# EAGLE design placasensores (EAGLE 9.6.2)
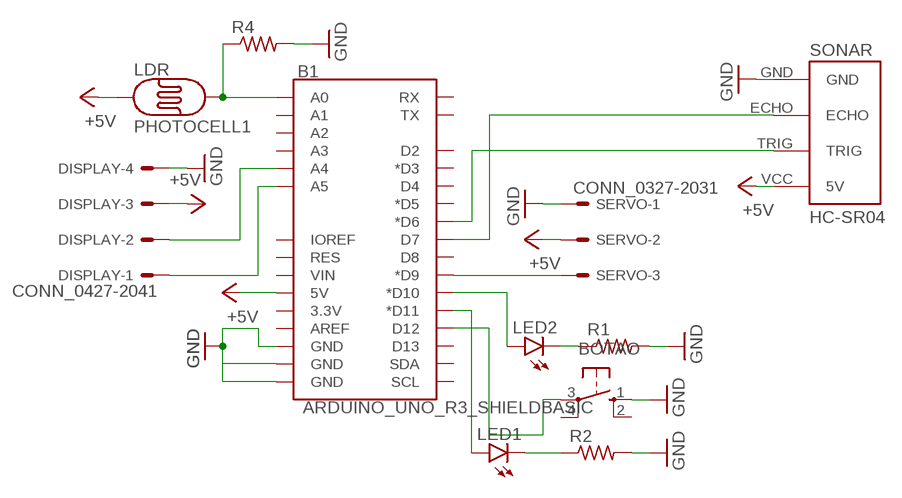
[diagram p0: schematic, sheet 1]

## Parts
B1  ARDUINO_UNO_R3_SHIELDBASIC  [UNO_R3_SHIELD]
BOTAO  10-XX  [B3F-10XX]
DISPLAY  CONN_0427-2041  [6410-04]
LDR  PHOTOCELL1  [LDR_OFFBOARD]
LED1  LED5MM  [LED5MM]
LED2  LED5MM  [LED5MM]
R1  R-US_0204/5  [0204/5]
R2  R-US_0204/5  [0204/5]
R4  R-US_0204/5  [0204/5]
SERVO  CONN_0327-2031  [6410-03]
SONAR  HC-SR04  [HC-SR04_FOOTPRINT]

## Nets
+5V: B1.5V DISPLAY.3 LDR.1 SERVO.2 SONAR.VCC(5V)
GND: B1.GND@0(GND) B1.GND@1(GND) B1.GND@2(GND) BOTAO.1(S) DISPLAY.4 R1.2 R2.2 R4.2 SERVO.1 SONAR.GND
N$1: B1.D12 BOTAO.3(P)
N$2: B1.D10(*D10) LED2.A
N$3: B1.D11(*D11) LED1.A
N$4: LED2.K(C) R1.1
N$5: LED1.K(C) R2.1
N$6: B1.A0 LDR.2 R4.1
N$7: B1.D7 SONAR.ECHO
N$8: B1.D6(*D6) SONAR.TRIG
N$9: B1.D9(*D9) SERVO.3
N$10: B1.A5 DISPLAY.1
N$11: B1.A4 DISPLAY.2
Unconnected: B1.3.3V B1.A1 B1.A2 B1.A3 B1.AREF B1.D2 B1.D3(*D3) B1.D4 B1.D5(*D5) B1.D8 B1.D13 B1.IOREF B1.RES B1.RX B1.SCL B1.SDA B1.TX B1.VIN BOTAO.2(S1) BOTAO.4(P1)

## Library data of the parts
B1 = Robotica-IFRN-SC-Arduino:ARDUINO_UNO_R3_SHIELD: Arduino R3 Shield Footprint Shield form compatible with the Arduino Uno R3. SparkFun Products: MG2639 Cellular Shield <https://www.sparkfun.com/products/13120> MIDI Shield <https://www.sparkfun.com/products/12898> R3 Stackable Headers Kit <https://www.sparkfun.com/products/11417>
BOTAO = switch-omron:10-XX: OMRON SWITCH; MPN: B3F-1000; OC_FARNELL: 176432; OC_NEWARK: 36M3542
DISPLAY = Robotica-IFRN-SC-conectores:CONN_04: CONNECTOR wire to board 2.54 mm (.1 inch) pitch header; OC_FARNELL: unknown; OC_NEWARK: unknown
LDR = ldr:PHOTOCELL: Photo Resitor
LED1 LED2 = led:LED: LED OSRAM: - CHIPLED LG R971, LG N971, LY N971, LG Q971, LY Q971, LO R971, LY R971 LH N974, LH R974 LS Q976, LO Q976, LY Q976 LO Q996 - Hyper CHIPLED LW Q18S LB Q993, LB Q99A, LB R99A - SideLED LS A670, LO A670, LY A670, LG A670, LP A670 LB A673, LV A673, LT A673, LW A673 LH A674 LY A675 LS A676, LA A676, LO A676, LY A676, LW A676 LS A679, LY A679, LG A679 - Hyper Micro SIDELED® LS Y876, LA Y876, LO Y876, LY Y876 LT Y87S - SmartLED LW L88C, LW L88S LB L89C, LB L89S, LG L890 LS L89K, LO L89K, LY L89K LS L896, LA L896, LO L896, LY L896 - TOPLED LS T670, LO T670, LY T670, LG T670, LP T670 LSG T670, LSP T670, LSY T670, LOP T670, LYG T670 LG T671, LOG T671, LSG T671 LB T673, LV T673, LT T673, LW T673 LH T674 LS T676, LA T676, LO T676, LY T676, LB T676, LH T676, LSB T676, LW T676 LB T67C, LV T67C, LT T67C, LS T67K, LO T67K, LY T67K, LW E67C LS E67B, LA E67B, LO E67B, LY E67B, LB E67C, LV E67C, LT E67C LW T67C LS T679, LY T679, LG T679 LS T770, LO T770, LY T770, LG T770, LP T770 LB T773, LV T773, LT T773, LW T773 LH T774 LS E675, LA E675, LY E675, LS T675 LS T776, LA T776, LO T776, LY T776, LB T776 LHGB T686 LT T68C, LB T68C - Hyper Mini TOPLED® LB M676 - Mini TOPLED Santana® LG M470 LS M47K, LO M47K, LY M47K Source: http://www.osram.convergy.de LUXEON: - LUMILED® LXK2-PW12-R00, LXK2-PW12-S00, LXK2-PW14-U00, LXK2-PW14-V00 LXK2-PM12-R00, LXK2-PM12-S00, LXK2-PM14-U00 LXK2-PE12-Q00, LXK2-PE12-R00, LXK2-PE12-S00, LXK2-PE14-T00, LXK2-PE14-U00 LXK2-PB12-K00, LXK2-PB12-L00, LXK2-PB12-M00, LXK2-PB14-N00, LXK2-PB14-P00, LXK2-PB14-Q00 LXK2-PR12-L00, LXK2-PR12-M00, LXK2-PR14-Q00, LXK2-PR14-R00 LXK2-PD12-Q00, LXK2-PD12-R00, LXK2-PD12-S00 LXK2-PH12-R00, LXK2-PH12-S00 LXK2-PL12-P00, LXK2-PL12-Q00, LXK2-PL12-R00 Source: www.luxeon.com KINGBRIGHT: KA-3528ASYC Source: www.kingbright.com
R1 R2 R4 = rcl:R-US_: RESISTOR, American symbol; SPICEPREFIX: R
SERVO = Robotica-IFRN-SC-conectores:CONN_03: CONNECTOR wire to board 2.54 mm (.1 inch) pitch header; OC_FARNELL: unknown; OC_NEWARK: unknown
SONAR = SONAR:HC-SR04: Ultrasonic Sensor HC-SR04

## Net classes
0 default: clearance 0.205 mm

## Board
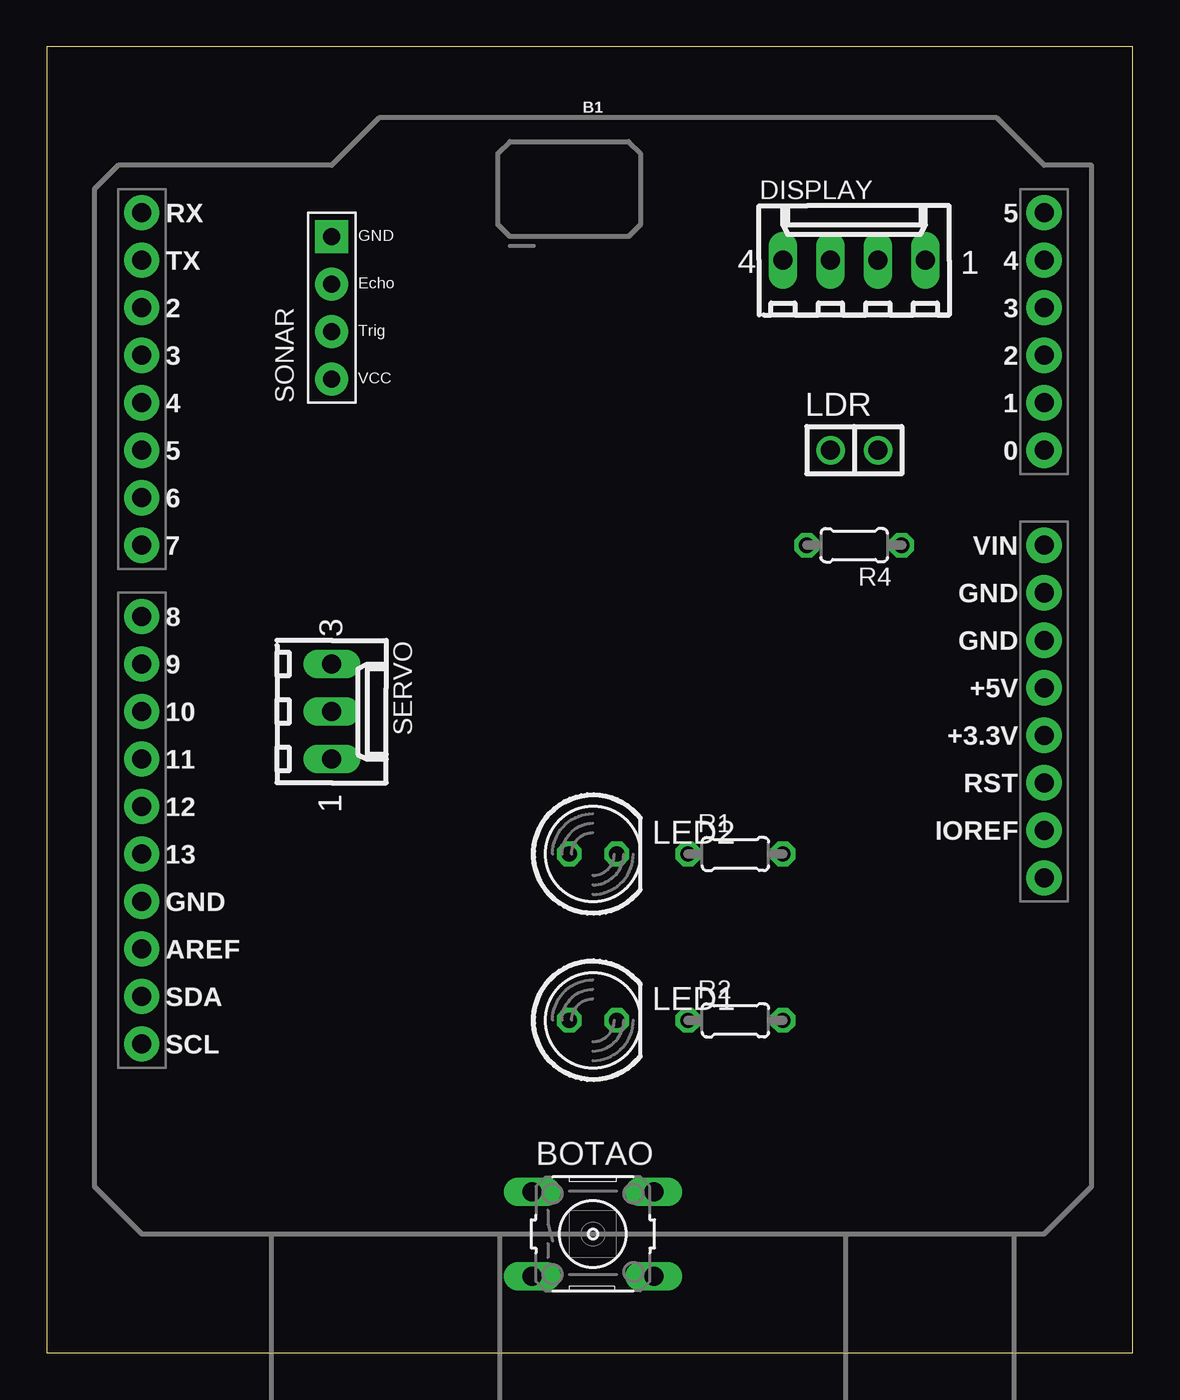
[diagram p1: board, top side]
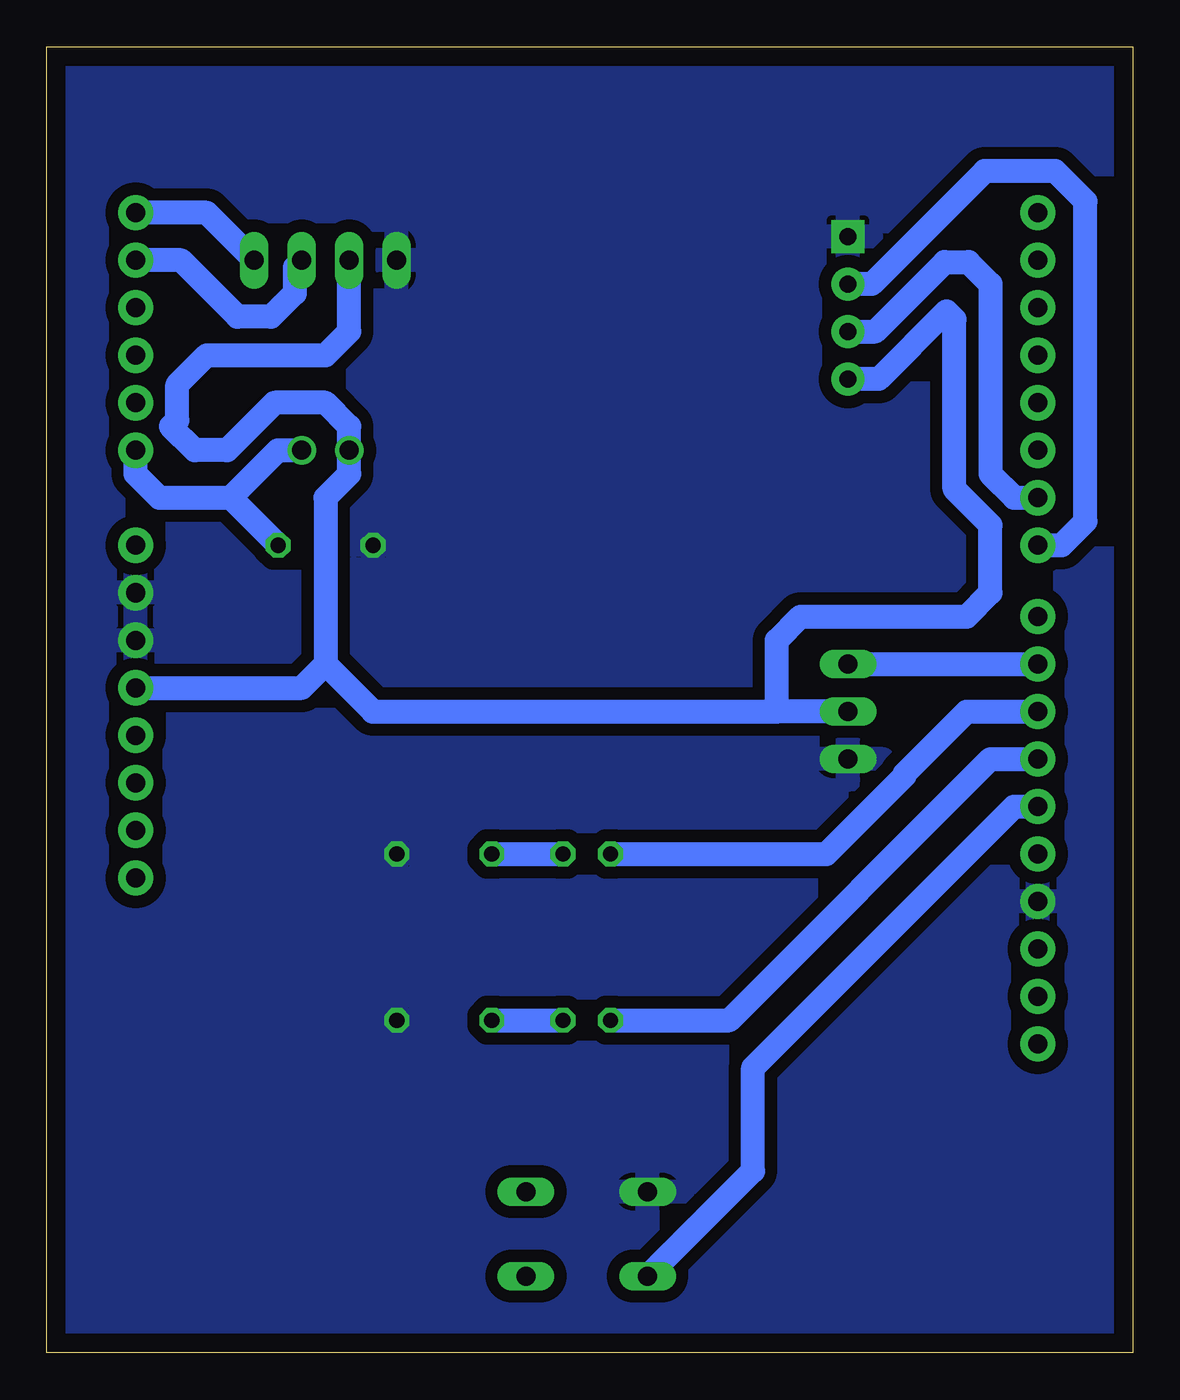
[diagram p2: board, bottom side, seen from below]

Size 58.09 x 69.84 mm. Coordinates in mm from the lower left corner, seen from the top.
Outline: 58.09,69.84 0,69.84 0,0 58.09,0 58.09,69.84
Copper layers (1*16): Top 0.035mm / dielectric 1.5mm / Bottom 0.035mm
Design rules "default *": minimum track width 6mil, minimum drill 24mil, track to track 26mil, track to pad 26mil, pad to pad 26mil, via to via 26mil, smd to smd 8mil, copper to edge 40mil, drill to drill 8mil, minimum pad ring 10mil, minimum via ring 8mil, stop-mask expansion 4mil, vias tented up to drill 0mil, thermal gap 10mil

### Footprints (pad centres in the part's own frame; a part is rotated, then mirrored left to right if it is on the bottom)
UNO_R3_SHIELD = drill 1.016 pad 1.88: 3.3V 24.13,-2.54; 5V 24.13,0; A0 24.13,12.7; A1 24.13,15.24; A2 24.13,17.78; A3 24.13,20.32; A4 24.13,22.86; A5 24.13,25.4; AREF -24.13,-13.97; D2 -24.13,20.32; D3 -24.13,17.78; D4 -24.13,15.24; D5 -24.13,12.7; D6 -24.13,10.16; D7 -24.13,7.62; D8 -24.13,3.81; D9 -24.13,1.27; D10 -24.13,-1.27; D11 -24.13,-3.81; D12 -24.13,-6.35; D13 -24.13,-8.89; GND@0 24.13,2.54; GND@1 24.13,5.08; GND@2 -24.13,-11.43; IOREF 24.13,-7.62; NC 24.13,-10.16; RES 24.13,-5.08; RX -24.13,25.4; SCL -24.13,-19.05; SDA -24.13,-16.51; TX -24.13,22.86; VIN 24.13,7.62
B3F-10XX = drill 1.016 long: 1 -3.251,2.261; 2 3.251,2.261; 3 -3.251,-2.261; 4 3.251,-2.261
6410-04 = drill 1.016 long: 1 3.81,0; 2 1.27,0; 3 -1.27,0; 4 -3.81,0
LDR_OFFBOARD = drill 1.016: 1 -1.27,0; 2 1.27,0
LED5MM = drill 0.813 octagon: A -1.27,0; K 1.27,0
0204/5 = drill 0.813 octagon: 1 -2.54,0; 2 2.54,0
6410-03 = drill 1.016 long: 1 2.54,0; 2 0,0; 3 -2.54,0
HC-SR04_FOOTPRINT = drill 0.9 pad 1.778: ECHO 0,1.27; TRIG 0,-1.27; VCC 0,-3.81 | drill 0.9 pad 1.778 square: GND 0,3.81

### Placement (x,y rotation side)
B1  29.21,35.56 0 top
BOTAO  29.21,6.35 0 top
DISPLAY  43.18,58.42 0 top
LDR  43.18,48.26 0 top
LED1  29.21,17.78 0 top
LED2  29.21,26.67 0 top
R1  36.83,26.67 0 top
R2  36.83,17.78 0 top
R4  43.18,43.18 180 top
SERVO  15.24,34.29 270 top
SONAR  15.24,55.88 0 top

### Tracks (layer width: path | path; a pad name or v marks a point on that pad's centre or on a via)
+5V
  Bottom 1.27: B1.5V 44.45,35.56 43.18,36.83 | 43.18,36.83 43.18,45.72 41.91,46.99 LDR.1 41.91,49.53 43.18,50.8 45.91,50.8 48.45,48.26 50.18,48.26 51.45,49.53 51.11,49.87 51.11,51.77 49.53,53.34 43.18,53.34 41.91,54.61 DISPLAY.3 | 43.18,36.83 40.64,34.29 19.05,34.29 | SERVO.2 19.05,34.29 | 19.05,34.29 19.05,38.1 17.78,39.37 8.89,39.37 7.62,40.64 7.62,44.26 9.55,46.19 9.55,55.27 9.97,55.69 13.59,52.07 SONAR.VCC
GND
  pour Bottom: 0,69.85 58.42,69.85 58.42,0 0,0
N$1
  Bottom 1.27: BOTAO.3 20.32,9.73 20.32,15.24 6.35,29.21 B1.D12
N$2
  Bottom 1.27: LED2.A 16.4,26.67 12.22,30.86 12.22,30.96 8.89,34.29 B1.D10
N$3
  Bottom 1.27: LED1.A 21.59,17.78 7.62,31.75 B1.D11
N$4
  Bottom 1.27: R1.1 LED2.K
N$5
  Bottom 1.27: R2.1 LED1.K
N$6
  Bottom 1.27: R4.1 48.26,45.72 | 48.26,45.72 52.07,45.72 53.34,46.99 B1.A0 | 48.26,45.72 45.72,48.26 LDR.2
N$7
  Bottom 1.27: B1.D7 3.81,43.18 2.54,44.45 2.54,61.58 4.15,63.2 7.93,63.2 13.97,57.15 SONAR.ECHO
N$8
  Bottom 1.27: SONAR.TRIG 13.78,54.61 10.07,58.33 8.79,58.33 7.62,57.15 7.62,46.99 6.35,45.72 B1.D6
N$9
  Bottom 1.27: SERVO.3 B1.D9
N$10
  Bottom 1.27: DISPLAY.1 49.53,60.96 B1.A5
N$11
  Bottom 1.27: DISPLAY.2 44.83,58.04 44.83,56.66 46.1,55.4 47.88,55.4 50.91,58.42 B1.A4